# EAGLE design IoT_Week_7 (EAGLE 9.6.2)
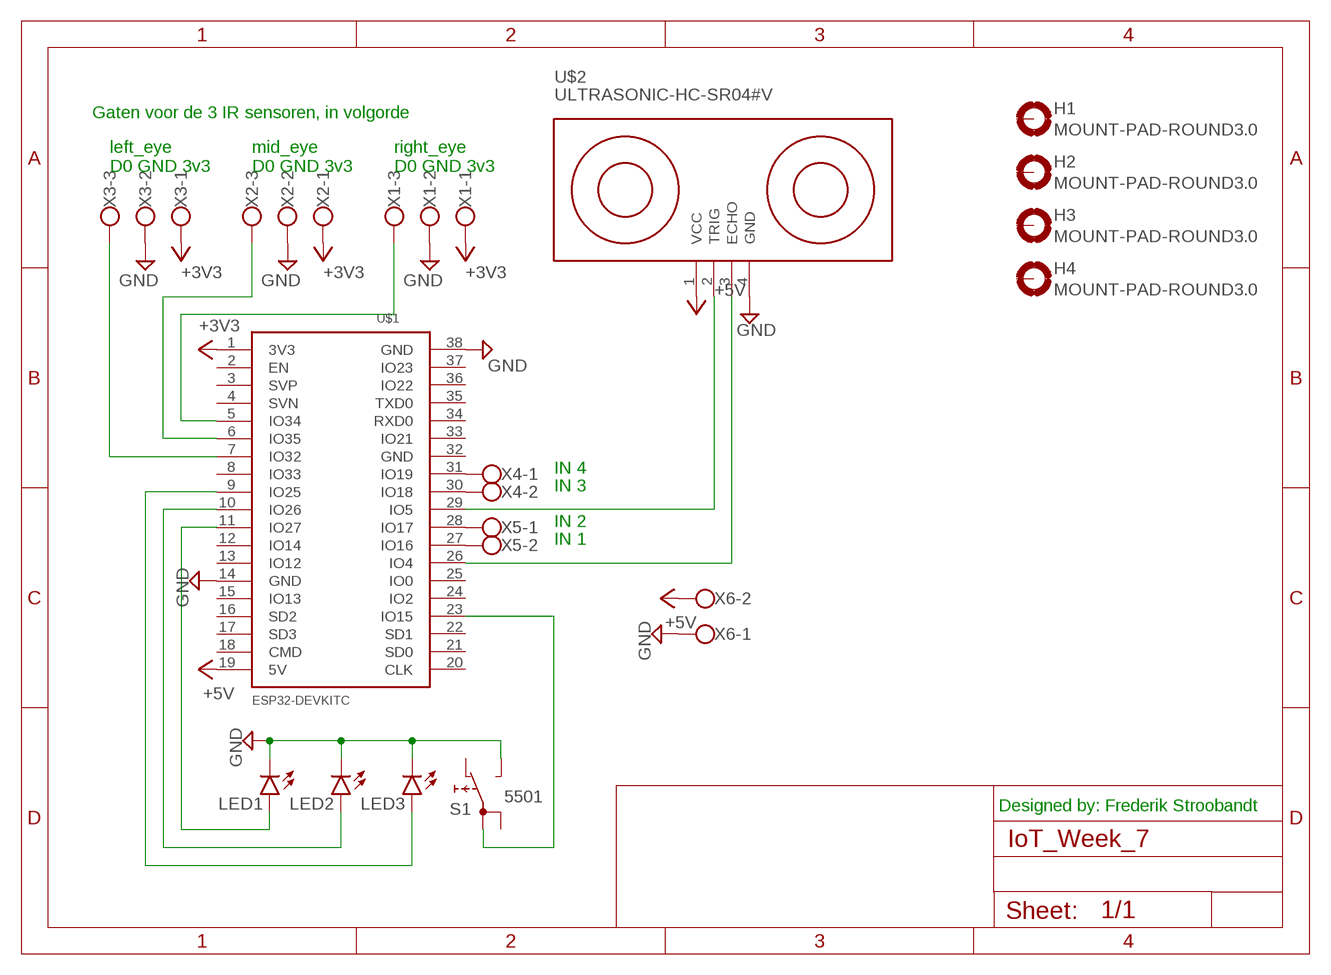
[diagram p0: schematic, sheet 1]

## Parts
H1  MOUNT-PAD-ROUND3.0  [3,0-PAD]
H2  MOUNT-PAD-ROUND3.0  [3,0-PAD]
H3  MOUNT-PAD-ROUND3.0  [3,0-PAD]
H4  MOUNT-PAD-ROUND3.0  [3,0-PAD]
LED1  LAP4-BOTTOM  [P47F-BOTTOM]
LED2  LAP4-BOTTOM  [P47F-BOTTOM]
LED3  LAP4-BOTTOM  [P47F-BOTTOM]
S1  5501  [5501]
U$1  ESP32DEVKITC  [ESP32-DEVKITC]
U$2  ULTRASONIC-HC-SR04#V  [ULTRASONIC-HC-SR04#V]
X1  W237-103  [W237-103]
X2  W237-103  [W237-103]
X3  W237-103  [W237-103]
X4  W237-102  [W237-102]
X5  W237-102  [W237-102]
X6  W237-102  [W237-102]

## Nets
+3V3: U$1.1(3V3) X1.1 X2.1 X3.1
+5V: U$1.19(5V) U$2.1(VCC) X6.2
GND: LED1.C LED2.C LED3.C S1.NO U$1.14(GND) U$1.38(GND) U$2.4(GND) X1.2 X2.2 X3.2 X6.1
N$1: U$1.27(IO16) X5.2
N$2: U$1.28(IO17) X5.1
N$3: U$1.31(IO19) X4.1
N$4: U$1.30(IO18) X4.2
N$5: U$1.5(IO34) X1.3
N$6: U$1.6(IO35) X2.3
N$7: U$1.7(IO32) X3.3
N$8: LED3.A U$1.9(IO25)
N$9: LED2.A U$1.10(IO26)
N$10: LED1.A U$1.11(IO27)
N$11: U$1.29(IO5) U$2.2(TRIG)
N$12: S1.1A U$1.23(IO15)
N$13: U$1.26(IO4) U$2.3(ECHO)
Unconnected: H1.B3,0(MOUNT) H2.B3,0(MOUNT) H3.B3,0(MOUNT) H4.B3,0(MOUNT) S1.1B S1.NC U$1.2(EN) U$1.3(SVP) U$1.4(SVN) U$1.8(IO33) U$1.12(IO14) U$1.13(IO12) U$1.15(IO13) U$1.16(SD2) U$1.17(SD3) U$1.18(CMD) U$1.20(CLK) U$1.21(SD0) U$1.22(SD1) U$1.24(IO2) U$1.25(IO0) U$1.32(GND) U$1.33(IO21) U$1.34(RXD0) U$1.35(TXD0) U$1.36(IO22) U$1.37(IO23)

## Notes on the sheet
- Gaten voor de 3 IR sensoren, in volgorde
- left_eye
  D0 GND 3v3
- mid_eye
  D0 GND 3v3
- right_eye
  D0 GND 3v3
- IN 4
- IN 3
- IN 2
- IN 1
- Designed by: Frederik Stroobandt

## Library data of the parts
H1-H4 = holes:MOUNT-PAD-ROUND: MOUNTING PAD, round
LED1-LED3 = led:*P4: PointLED® Enhanced Thinfilm LED TOP & BOTTOM mount LS P47F, LR P47F, LA P47F, LY P47F, LT P4SG, LB P4SG, LW P4SG Source: http://catalog.osram-os.com .. LA_LR_LS_LY_P47F_Pb_free.pdf
S1 = switch:55?: PUSHBUTTON SERIES 5500 SWITCHES Source: www.e-switch.com .. 5500.pdf
U$1 = ESP32-DEVKITC:ESP32DEVKITC
U$2 = diy-modules:ULTRASONIC-HC-SR04: Ultrasonic Ranging Module HC-SR04 More details available here: http://randomnerdtutorials.com/complete-guide-for-ultrasonic-sensor-hc-sr04/ Click here to find device on ebay.com <http://www.ebay.com/sch/hc+sr04+ultrasonic>
X1-X3 = con-wago-500:W237-103: WAGO SCREW CLAMP; MPN: 237-103; OC_FARNELL: unknown; OC_NEWARK: 18M7116
X4-X6 = con-wago-500:W237-102: WAGO SCREW CLAMP; MPN: 237-102; OC_FARNELL: unknown; OC_NEWARK: 70K9898

## Board
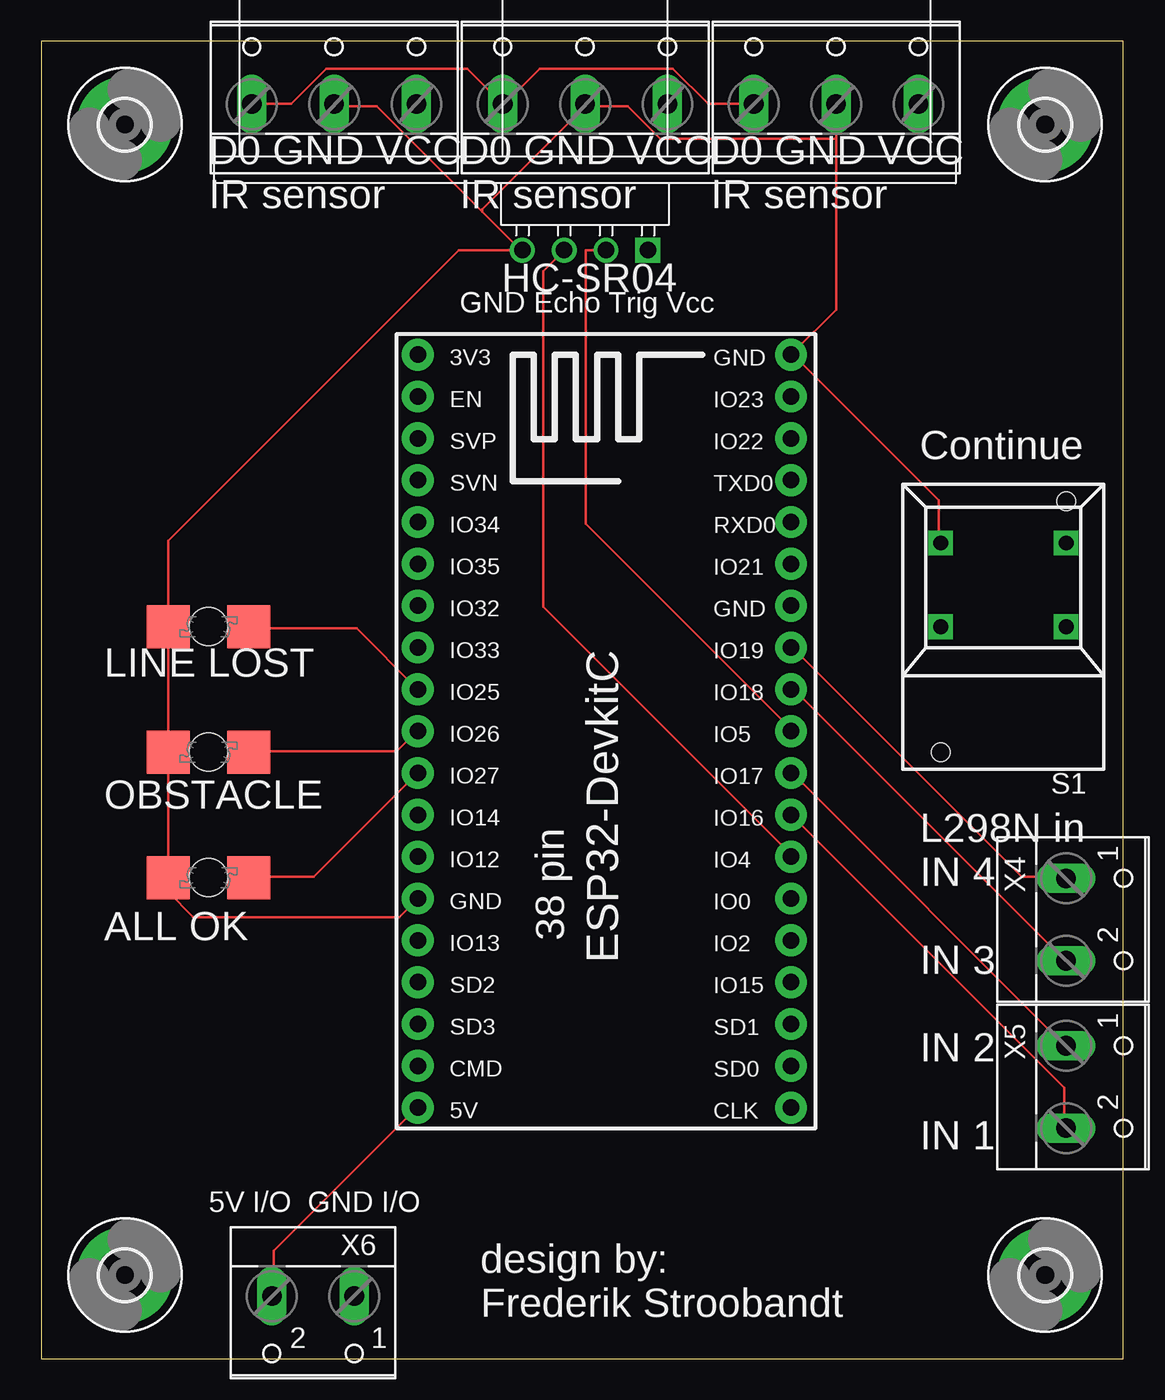
[diagram p1: board, top side]
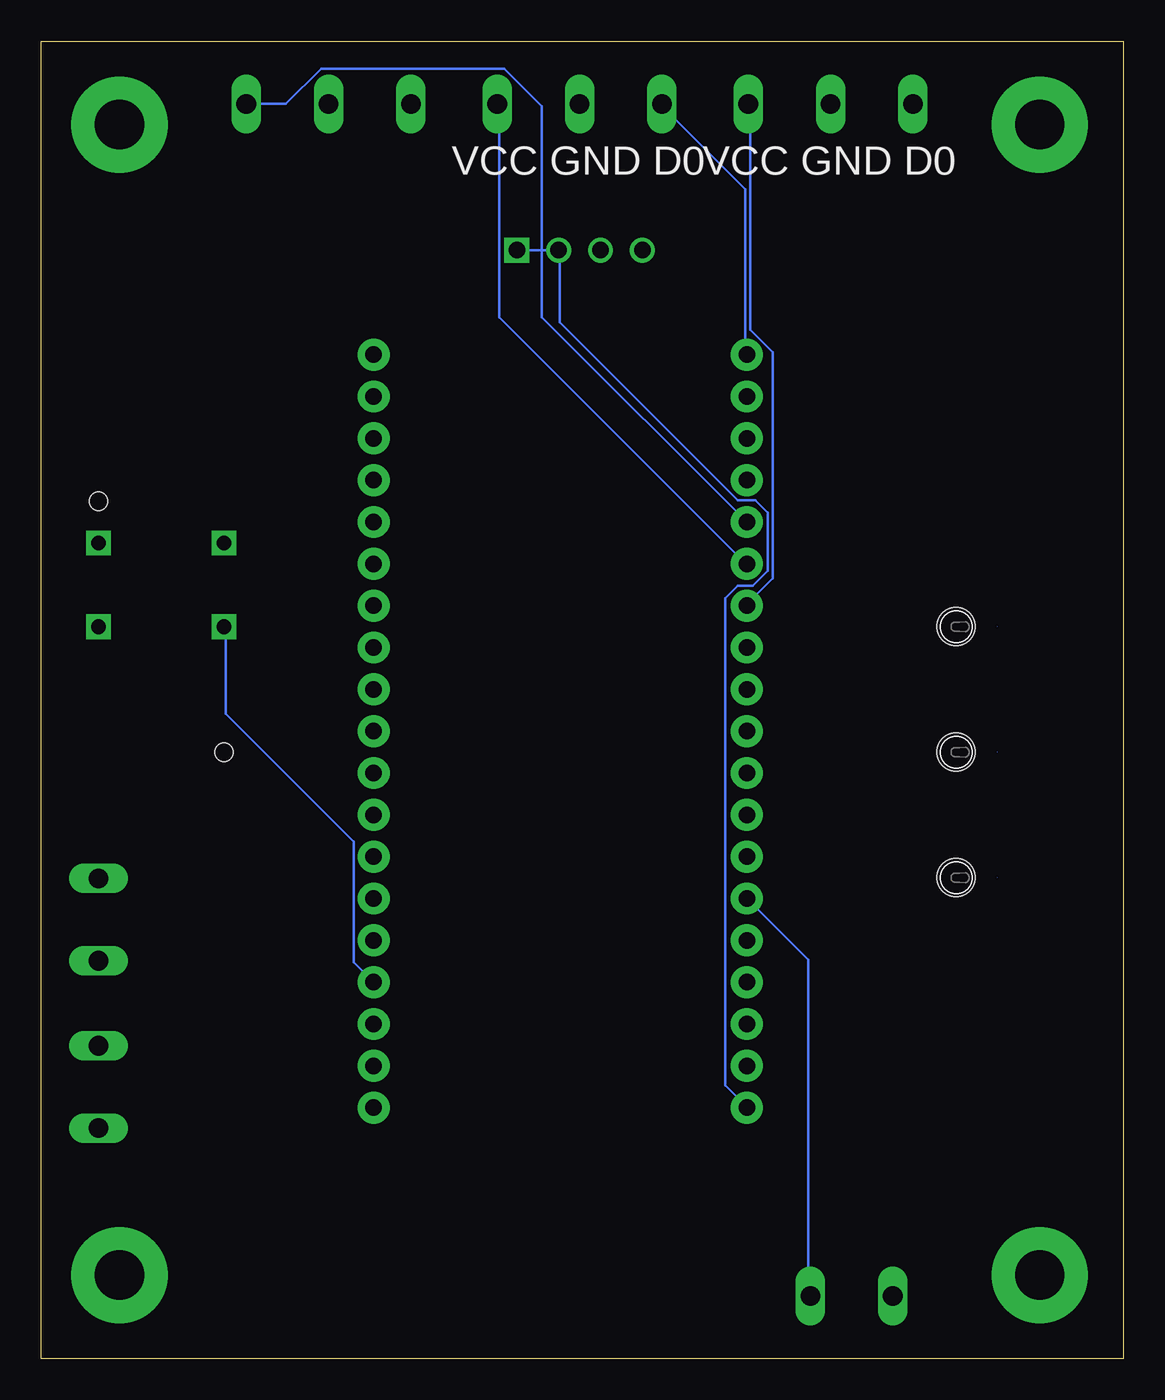
[diagram p2: board, bottom side, seen from below]

Size 65.71 x 80 mm. Coordinates in mm from the lower left corner, seen from the top.
Outline: 0,0 65.71,0 65.71,80 0,80 0,0
Copper layers (1*16): Top 0.035mm / dielectric 1.5mm / Bottom 0.035mm
Design rules "default": minimum track width 6mil, minimum drill 0.35mm, track to track 6mil, track to pad 6mil, pad to pad 6mil, via to via 6mil, smd to smd 6mil, copper to edge 40mil, drill to drill 6mil, minimum pad ring 10mil, minimum via ring 8mil, stop-mask expansion 4mil, vias tented up to drill 0mil, thermal gap 10mil

### Footprints (pad centres in the part's own frame; a part is rotated, then mirrored left to right if it is on the bottom)
3,0-PAD = drill 3 pad 5.842: B3,0 0,0
P47F-BOTTOM = smd 2.6 x 2.6: A -2.45,0; C 2.45,0 | hole 2.3: 0,0
5501 = drill 0.9 pad 1.5 square: 1A 0,3.81; 1B 0,-3.81; NC 5.08,-3.81; NO 5.08,3.81 | hole 1.1: -7.62,3.81; 7.62,-3.81
ESP32-DEVKITC = drill 1 pad 1.93: 1 -22.87,-11.42; 2 -20.33,-11.42; 3 -17.79,-11.42; 4 -15.25,-11.42; 5 -12.71,-11.42; 6 -10.17,-11.42; 7 -7.63,-11.42; 8 -5.09,-11.42; 9 -2.55,-11.42; 10 -0.01,-11.42; 11 2.53,-11.42; 12 5.07,-11.42; 13 7.61,-11.42; 14 10.15,-11.42; 15 12.69,-11.42; 16 15.23,-11.42; 17 17.77,-11.42; 18 20.31,-11.42; 19 22.85,-11.42; 20 22.85,11.23; 21 20.31,11.23; 22 17.77,11.23; 23 15.23,11.23; 24 12.69,11.23; 25 10.15,11.23; 26 7.61,11.23; 27 5.07,11.23; 28 2.53,11.23; 29 -0.01,11.23; 30 -2.55,11.23; 31 -5.09,11.23; 32 -7.63,11.23; 33 -10.17,11.23; 34 -12.71,11.23; 35 -15.25,11.23; 36 -17.79,11.23; 37 -20.33,11.23; 38 -22.87,11.23
ULTRASONIC-HC-SR04#V = drill 1 square: 1 -3.81,0 | drill 1: 2 -1.27,0; 3 1.27,0; 4 3.81,0
W237-103 = drill 1.194 long: 1 -5,-1.29; 2 0,-1.29; 3 5,-1.29
W237-102 = drill 1.194 long: 1 -2.5,-1.27; 2 2.5,-1.27

### Placement (x,y rotation side)
H1  5.08,74.93 0 top
H2  60.96,74.93 0 top
H3  5.08,5.08 0 top
H4  60.96,5.08 0 top
LED1  10.16,29.21 180 top
LED2  10.16,36.83 180 top
LED3  10.16,44.45 180 top
S1  58.42,44.45 90 top
U$1  34.29,38.1 270 top
U$2  33.02,67.31 180 top
X1  48.26,77.47 0 top
X2  33.02,77.47 0 top
X3  17.78,77.47 0 top
X4  63.5,26.67 270 top
X5  63.5,16.51 270 top
X6  16.51,2.54 180 top

### Tracks (layer width: path | path; a pad name or v marks a point on that pad's centre or on a via)
+3V3
  Top 0.152: X3.1 12.9,76.2 15.19,76.2 17.32,78.33 25.86,78.33 27.99,76.2 X2.1 28.14,76.2 30.28,78.33 38.35,78.33 40.49,76.2 43.23,76.2 X1.1
  Bottom 0.152: U$1.1 22.96,61.11 22.96,71.02 27.99,76.05 X2.1
+5V
  Top 0.152: X6.2 14.12,3.81 14.12,6.55 22.81,15.24 U$1.19
  Bottom 0.152: U$2.1 34.24,67.31 34.24,62.94 23.42,52.12 22.35,52.12 21.59,51.36 21.59,47.85 22.5,46.94 23.42,46.94 24.18,46.18 24.18,16.61 22.96,15.39 U$1.19
GND
  Top 0.152: U$1.14 21.74,26.82 9.25,26.82 7.72,28.35 7.72,29.11 LED1.C 7.72,29.26 7.72,36.73 LED2.C 7.72,36.88 7.72,44.35 LED3.C 7.72,44.5 7.72,49.68 25.35,67.31 U$2.4 29.11,67.31 26.77,69.65 | 26.77,69.65 26.77,69.8 33.02,76.05 | 26.77,69.65 20.37,76.05 17.78,76.05 X3.2 | S1.NO 54.51,49.53 54.51,52.12 45.67,60.96 U$1.38 45.67,61.11 48.26,63.7 48.26,74.07 | 48.26,74.07 X1.2 | 33.02,76.05 35.61,76.05 37.59,74.07 48.26,74.07 | 33.02,76.05 X2.2
  Bottom 0.152: U$1.14 19.15,24.23 19.15,3.81 X6.1
N$1
  Top 0.152: X5.2 62.13,14.02 62.13,16.46 45.67,32.92 U$1.27
N$2
  Top 0.152: X5.1 62.13,19.05 45.67,35.51 U$1.28
N$3
  Top 0.152: X4.1 62.13,29.26 59.54,29.26 45.67,43.13 U$1.31
N$4
  Top 0.152: X4.2 62.13,24.23 45.67,40.69 U$1.30
N$5
  Bottom 0.152: U$1.5 35.31,63.25 35.31,76.05 37.59,78.33 48.72,78.33 50.85,76.2 53.14,76.2 X1.3
N$6
  Bottom 0.152: X2.3 37.9,76.05 37.9,63.25 22.96,48.31 U$1.6
N$7
  Bottom 0.152: X3.3 22.66,76.05 22.66,62.48 21.29,61.11 21.29,47.4 22.81,45.87 U$1.7
N$8
  Top 0.152: LED3.A 12.75,44.35 19.15,44.35 22.81,40.69 U$1.9
N$9
  Top 0.152: LED2.A 12.75,36.88 21.59,36.88 22.81,38.1 U$1.10
N$10
  Top 0.152: U$1.11 16.56,29.26 12.75,29.26 LED1.A
N$11
  Top 0.152: U$2.2 33.07,67.31 33.07,50.7 45.52,38.25 U$1.29
N$12
  Bottom 0.152: S1.1A 54.51,44.35 54.51,39.17 46.74,31.39 46.74,24.08 45.67,23.01 U$1.23
N$13
  Top 0.152: U$2.3 30.48,66.04 30.48,45.67 45.52,30.63 U$1.26

### Text on the board
tNames: D0 GND VCC / IR sensor | D0 GND VCC / IR sensor | D0 GND VCC / IR sensor | HC-SR04 | GND Echo Trig Vcc | Continue | LINE LOST / / / OBSTACLE / / / ALL OK | 38 pin | L298N in / IN 4 / / IN 3 / / IN 2 / / IN 1 | 5V I/O GND I/O | design by: / Frederik Stroobandt
bNames: VCC GND D0 | VCC GND D0